# Altium schematic sheet CableNodeRevG.SchDoc: Cable Node (part 1 of 3)
size C; Date: 20 Nov 2013; Author: JDV; CompanyName: OPIsystems Inc; DrawnBy: JDV; Engineer: JDV; Organization: OPIsystems Inc; DocumentNumber: 20130211; Revision: Rev G; SheetNumber: 1; SheetTotal: 1; PageSetup: Record=PageOptions|CenterHorizontal=True|CenterVertical=True|PrintScale=0.54|XCorrection=1.00|YCorrection=1.00|PrintKind=0|BorderSize=5000000|LeftOffset=0|BottomOffset=0|Orientation=2|PaperLength=4318|PaperWidth=2794|Scale=100|PaperSource=7|PrintQuality=600|MediaType=1|DitherType=10|PaperKind=11x17|PrintScaleMode=1; DocumentName: Cable Node; ProjectName: Swage
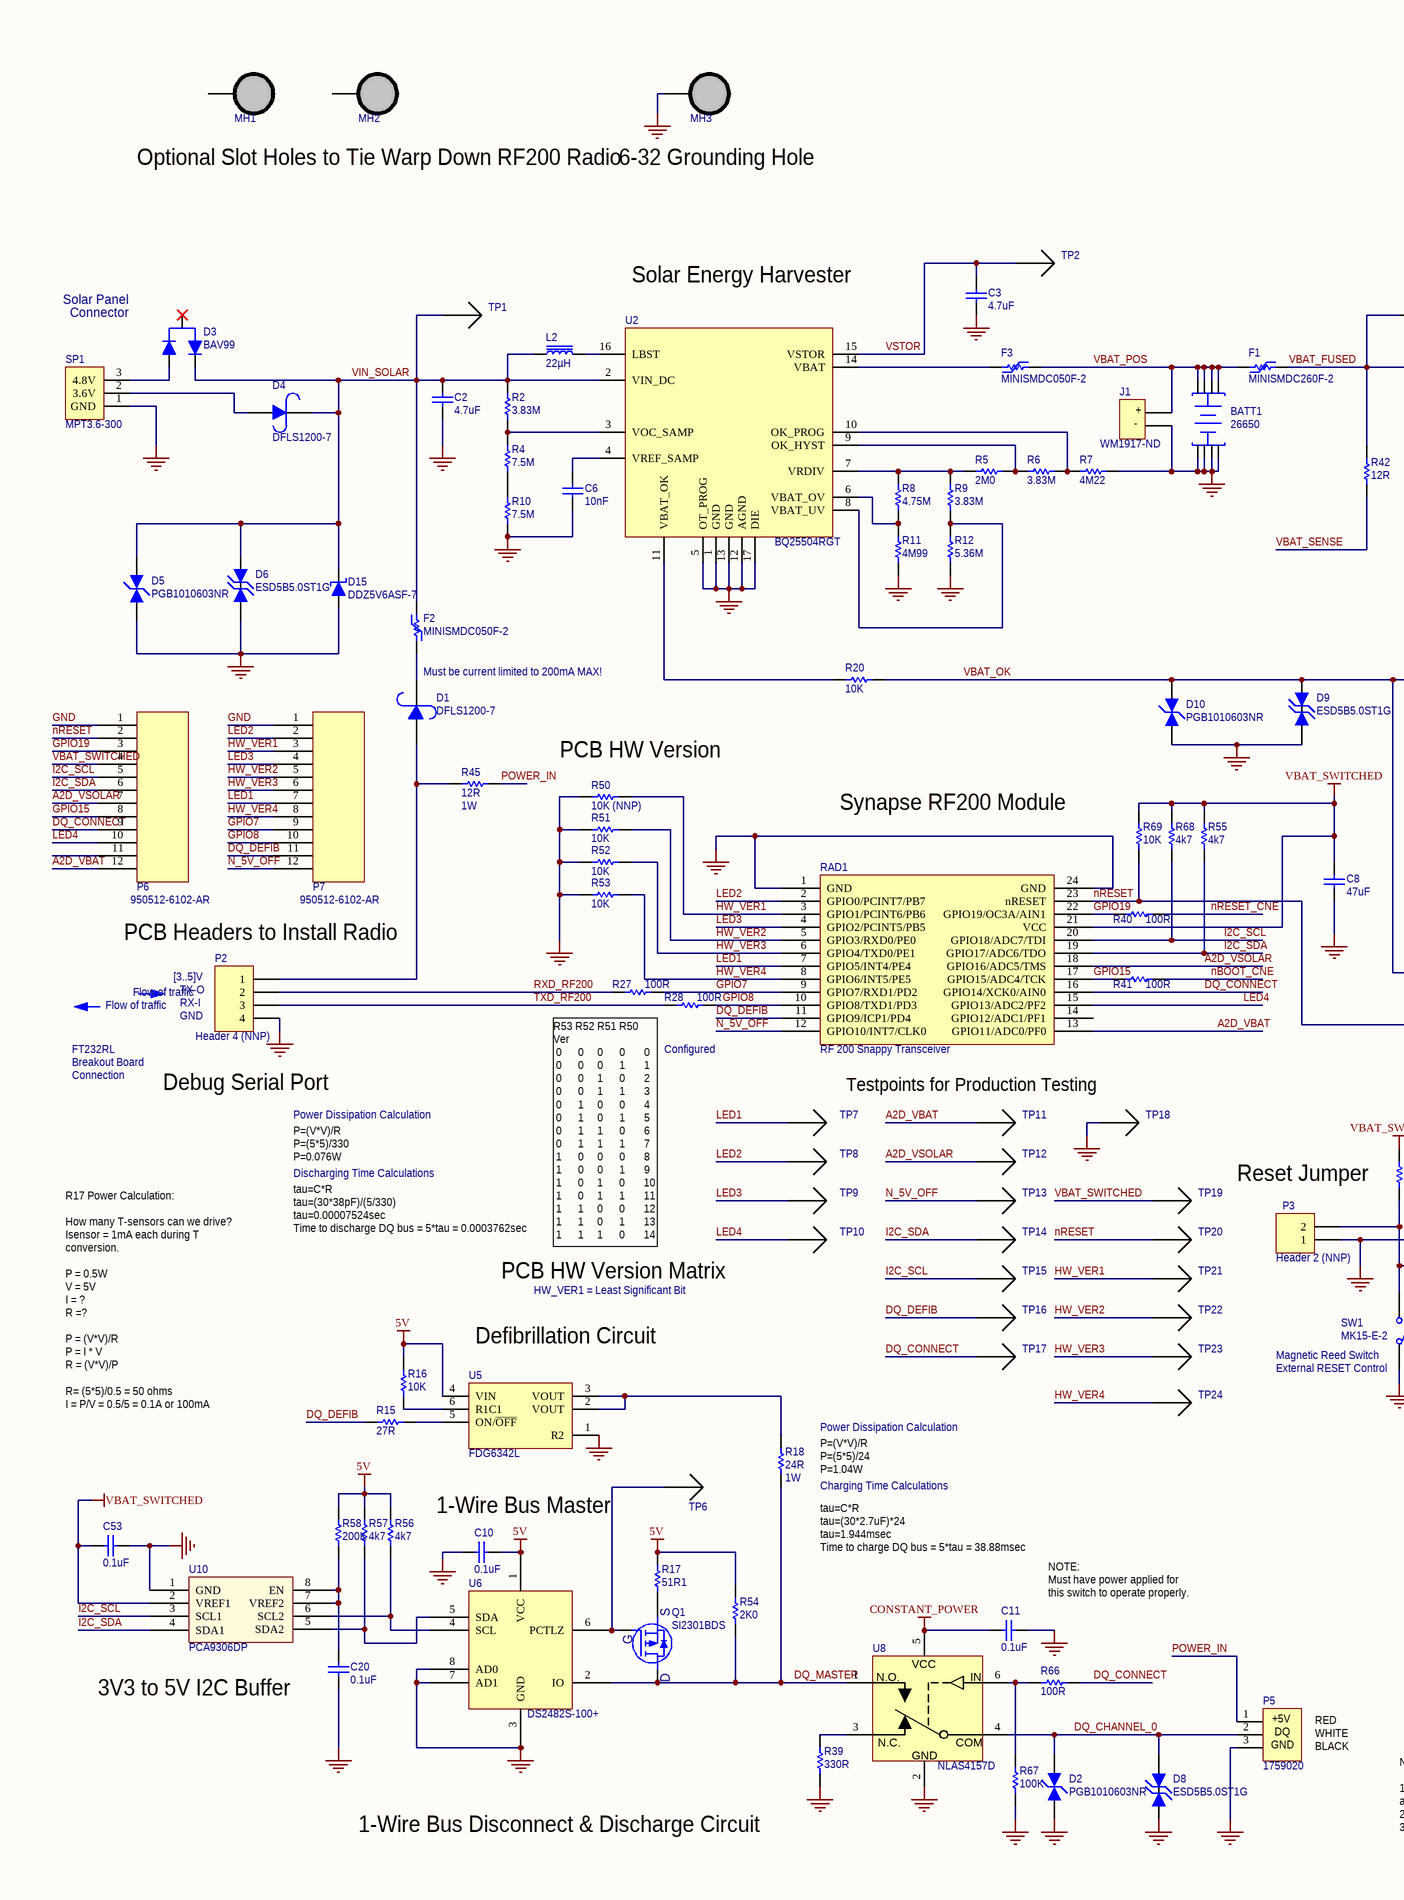
[diagram p0: CableNodeRevG.SchDoc, left]
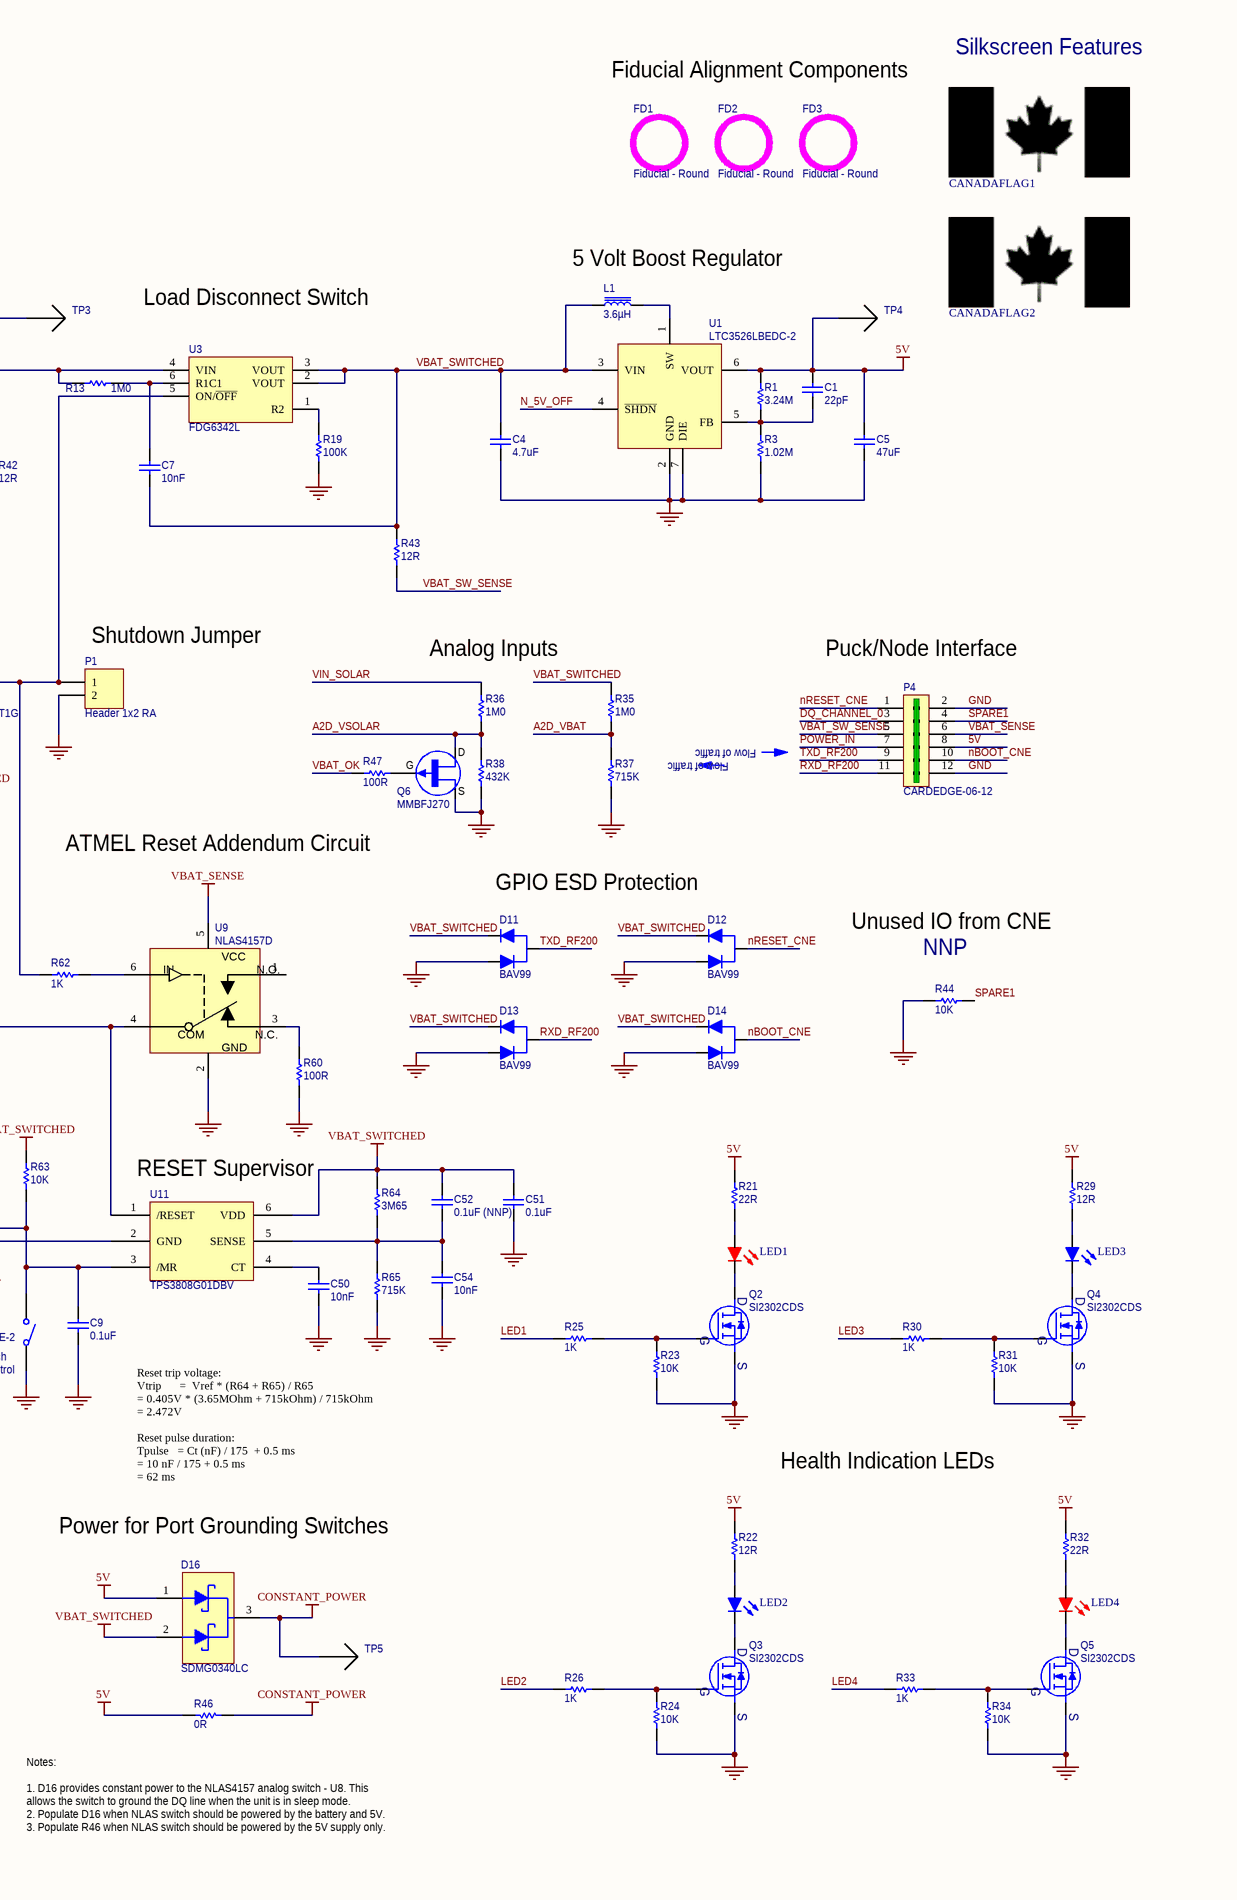
[diagram p1: CableNodeRevG.SchDoc, right]

## Parts
BATT1  26650  [Battery_26650]
C1  22pF  [RC0805]
C2  4.7uF  [RC0805]
C3  4.7uF  [RC0805]
C4  4.7uF  [RC0805]
C5  47uF  [RC1206]
C6  10nF  [RC0805]
C7  10nF  [RC0603]
C8  47uF  [RC1206]
C9  0.1uF  [RC0603]
C10  0.1uF  [RC0603]
C11  0.1uF  [RC0603]
C20  0.1uF  [RC0603]
C50  10nF  [RC0603]
C51  0.1uF  [RC0603]
C52  0.1uF (NNP)  [RC0603]
C53  0.1uF  [RC0603]
C54  10nF  [RC0603]
CANADAFLAG1  Canada Flag  [CanadaFlag500x250]  (value not drawn)
CANADAFLAG2  Canada Flag  [CanadaFlag500x250]  (value not drawn)
D1  DFLS1200-7  [POWERDI-123]
D2  PGB1010603NR  [RC0603]
D3  BAV99  [SOT23]
D4  DFLS1200-7  [POWERDI-123]
D5  PGB1010603NR  [RC0603]
D6  ESD5B5.0ST1G  [SOD-523]
D8  ESD5B5.0ST1G  [SOD-523]
D9  ESD5B5.0ST1G  [SOD-523]
D10  PGB1010603NR  [RC0603]
D11  BAV99  [SOT23]
D12  BAV99  [SOT23]
D13  BAV99  [SOT23]
D14  BAV99  [SOT23]
D15  DDZ5V6ASF-7  [SOD323F]
D16  SDMG0340LC  [SOT-323]
F1  MINISMDC260F-2  [MINISMDC260F]
F2  MINISMDC050F-2  [MINISMD050]
F3  MINISMDC050F-2  [MINISMD050]
FD1  Fiducial - Round  [FIDUCIAL ROUND SMALL]
FD2  Fiducial - Round  [FIDUCIAL ROUND SMALL]
FD3  Fiducial - Round  [FIDUCIAL ROUND SMALL]
J1  Supplier Part Number 1: WM1917-ND  [BATTERYCONNECTOR]  (hidden comment: CONN)
L1  3.6µH  [IND-WURTH]
L2  22µH  [IND-SRR0604]
LED1  GH_JTLPS1.24-K5L2-1-1-150-R33  [GHJTLPS124K5L211150R33]  (value not drawn)
LED2  GD JTLPS1.14-MFN8-25-1-150-R33  [GHJTLPS124K5L211150R33]  (value not drawn)
LED3  GD JTLPS1.14-MFN8-25-1-150-R33  [GHJTLPS124K5L211150R33]  (value not drawn)
LED4  GH_JTLPS1.24-K5L2-1-1-150-R33  [GHJTLPS124K5L211150R33]  (value not drawn)
MH1  MountingHole  [MountingHole]  (value not drawn)
MH2  MountingHole  [MountingHole]  (value not drawn)
MH3  MountingHole  [MountingHole]  (value not drawn)
P1  Header 1x2 RA  [HDR1X2]
P2  Header 4 (NNP)  [HDR1X4]
P3  Header 2 (NNP)  [HDR1X2]
P4  CARDEDGE-06-12  [EdgeConnectorFingers]
P5  1759020  [PC-1759020]
P6  Manufacturer Part Number: 950512-6102-AR  [HEADER1X12-2MM]  (hidden comment: 3M-950512-6102-AR)
P7  Manufacturer Part Number: 950512-6102-AR  [HEADER1X12-2MM]  (hidden comment: 3M-950512-6102-AR)
Q1  SI2301BDS  [SOT23(DGS)]
Q2  SI2302CDS  [SOT23]
Q3  SI2302CDS  [SOT23]
Q4  SI2302CDS  [SOT23]
Q5  SI2302CDS  [SOT23]
Q6  MMBFJ270  [SOT23]
R1  3.24M  [RC0805]
R2  3.83M  [RC0603]
R3  1.02M  [RC0805]
R4  7.5M  [RC0603]
R5  2M0  [RC0603]
R6  3.83M  [RC0603]
R7  4M22  [RC0603]
R8  4.75M  [rc0603]
R9  3.83M  [RC0603]
R10  7.5M  [RC0603]
R11  4M99  [rc0603]
R12  5.36M  [RC0603]
R13  1M0  [RESC1608X06N]
R15  27R  [RC0603]
R16  10K  [RC0603]
R17  51R1  [RC3225X07N]
R18  24R  Power (Watts): 1W  [RES2512]
R19  100K  [RC0603]
R20  10K  [RC0603]
R21  22R  [RC1206]
R22  12R  [RC1206]
R23  10K  [RC0603]
R24  10K  [RC0603]
R25  1K  [rc0603]
R26  1K  [rc0603]
R27  100R  [RC0603]
R28  100R  [RC0603]
R29  12R  [RC1206]
R30  1K  [rc0603]
R31  10K  [RC0603]
R32  22R  [RC1206]
R33  1K  [rc0603]
R34  10K  [RC0603]
R35  1M0  [rc0603]
R36  1M0  [rc0603]
R37  715K  [RC0603]
R38  432K  [RC0603]
R39  330R  [RC0805]
R40  100R  [RC0603]
R41  100R  [RC0603]
R42  12R  [RC1206]
R43  12R  [RC1206]
R44  10K  [RC0603]
R45  12R  Power (Watts): 1W  [RES2512]
R46  0R  [RC0603]
R47  100R  [RC0603]
R50  10K (NNP)  [RC0603]
R51  10K  [RC0603]
R52  10K  [RC0603]
R53  10K  [RC0603]
R54  2K0  [RC0603]
R55  4k7  [RC0603]
R56  4k7  [RC0603]
R57  4k7  [RC0603]
R58  200K  [RC0603]
R60  100R  [RC0603]
R62  1K  [rc0603]
R63  10K  [RC0603]
R64  3M65  [RC0603]
R65  715K  [RC0603]
R66  100R  [RC0603]
R67  100K  [RC0603]
R68  4k7  [RC0603]
R69  10K  [RC0603]
RAD1  RF 200 Snappy Transceiver  [RF200]
SP1  MPT3.6-300  [SOLAR_PANEL_FLEX]
SW1  MK15-E-2  [MK15-E-2]
TP1  Testpoint  [TestPoint]  (value not drawn)
TP2  Testpoint  [TestPoint]  (value not drawn)
TP3  Testpoint  [TestPoint]  (value not drawn)
TP4  Testpoint  [TestPoint]  (value not drawn)
TP5  Testpoint  [TestPoint]  (value not drawn)
TP6  Testpoint  [TestPoint]  (value not drawn)
TP7  Testpoint  [TestPoint]  (value not drawn)
TP8  Testpoint  [TestPoint]  (value not drawn)
TP9  Testpoint  [TestPoint]  (value not drawn)
TP10  Testpoint  [TestPoint]  (value not drawn)
TP11  Testpoint  [TestPoint]  (value not drawn)
TP12  Testpoint  [TestPoint]  (value not drawn)
TP13  Testpoint  [TestPoint]  (value not drawn)
TP14  Testpoint  [TestPoint]  (value not drawn)
TP15  Testpoint  [TestPoint]  (value not drawn)
TP16  Testpoint  [TestPoint]  (value not drawn)
TP17  Testpoint  [TestPoint]  (value not drawn)
TP18  Testpoint  [TestPoint]  (value not drawn)
TP19  Testpoint  [TestPoint]  (value not drawn)
TP20  Testpoint  [TestPoint]  (value not drawn)
TP21  Testpoint  [TestPoint]  (value not drawn)
TP22  Testpoint  [TestPoint]  (value not drawn)
TP23  Testpoint  [TestPoint]  (value not drawn)
TP24  Testpoint  [TestPoint]  (value not drawn)
U1  LTC3526LBEDC-2  [LTC3526]
U2  BQ25504RGT  [BQ25504]
U3  FDG6342L  [TS5A3160]
U5  FDG6342L  [TS5A3160]
U6  DS2482S-100+  [SOIC127P580X153-8N]
U8  NLAS4157D  [TS5A3160]
U9  NLAS4157D  [TS5A3160]
U10  PCA9306DP  [TSOP65P640X120-8N]
U11  TPS3808G01DBV  [SOT95P270X145-6N]

## Nets
5V: C1.2 C5.2 C10.2 D16.1(A) P4.8(DESIGNATOR=8) R1.2 R16.2 R17.1 R21.1 R22.1 R29.1 R32.1 R46.1 R54.1 R56.2 R57.2 R58.1 TP4.1 U1.6(VOUT) U5.4(VIN) U6.1(VCC)
CONSTANT_POWER: C11.1 D16.3(K) R46.2 TP5.1 U8.5
GND: BATT1.5 BATT1.6 BATT1.7 BATT1.8 C2.1 C3.1 C4.1 C5.1 C6.1 C8.1 C9.1 C10.1 C11.2 C20.1 C50.1 C51.1 C53.1 C54.1 D2.1 D5.1 D6.2 D8.1 D9.2 D10.1 D11.1(A) D12.1(A) D13.1(A) D14.1(A) D15.2 J1.2 MH3.1 P1.2 P2.4 P3.1 P4.2(DESIGNATOR=2) P4.12(DESIGNATOR=12) P5.3 P6.1 P7.1 Q2.2(S) Q3.2(S) Q4.2(S) Q5.2(S) Q6.2(S) R3.2 R7.2 R10.2 R11.2 R12.2 R19.2 R23.2 R24.2 R31.2 R34.2 R37.1 R38.1 R39.2 R44.1 R50.2 R51.2 R52.2 R53.2 R60.2 R65.1 R67.2 RAD1.1(GND) RAD1.24(GND) SP1.1(GND) SW1.1 TP18.1 U1.2(GND) U1.7(DIE) U2.1(GND) U2.5(OT_PROG) U2.12(AGND) U2.13(GND) U2.17(DIE) U5.1(R2) U6.3(GND) U6.7(AD1) U6.8(AD0) U8.2(GND) U9.2(GND) U10.1(GND) U11.2(GND)
VBAT_SENSE: P4.6(DESIGNATOR=6) R42.2 U9.5
VBAT_SWITCHED: C4.2 C7.1 C8.2 C51.2 C52.2 C53.2 D11.2(K) D12.2(K) D13.2(K) D14.2(K) D16.2(A) L1.A P6.4 R35.1 R43.1 R55.2 R63.1 R64.1 R68.2 R69.1 RAD1.21(VCC) TP19.1 U1.3(VIN) U3.2(VOUT) U3.3(VOUT) U10.2(VREF1) U11.6(VDD)
A2D_VBAT: P6.12 R35.2 R37.2 RAD1.13(GPIO11/ADC0/PF0) TP11.1
A2D_VSOLAR: P6.7 Q6.1(D) R36.2 R38.2 RAD1.18(GPIO16/ADC5/TMS) TP12.1
DQ_CHANNEL_0: D2.2 D8.2 P4.3(DESIGNATOR=3) P5.2 U8.4
DQ_CONNECT: P6.9 R66.1 RAD1.16(GPIO14/XCK0/AIN0) TP17.1
DQ_DEFIB: P7.11 R15.1 RAD1.11(GPIO9/ICP1/PD4) TP16.1
DQ_MASTER: Q1.D R18.2 R54.2 U6.2(IO) U8.1(NO)
GPIO7: P7.9 R27.1 RAD1.9(GPIO7/RXD1/PD2)
GPIO8: P7.10 R28.1 RAD1.10(GPIO8/TXD1/PD3)
GPIO15: P6.8 R41.2 RAD1.17(GPIO15/ADC4/TCK)
GPIO19: P6.3 R40.2 RAD1.22(GPIO19/OC3A/AIN1)
HW_VER1: P7.3 R50.1 RAD1.3(GPIO1/PCINT6/PB6) TP21.1
HW_VER2: P7.5 R51.1 RAD1.5(GPIO3/RXD0/PE0) TP22.1
HW_VER3: P7.6 R52.1 RAD1.6(GPIO4/TXD0/PE1) TP23.1
HW_VER4: P7.8 R53.1 RAD1.8(GPIO6/INT5/PE5) TP24.1
I2C_SCL: P6.5 R68.1 RAD1.20(GPIO18/ADC7/TDI) TP15.1 U10.3(SCL1)
I2C_SDA: P6.6 R55.1 RAD1.19(GPIO17/ADC6/TDO) TP14.1 U10.4(SDA1)
LED1: P7.7 R25.1 RAD1.7(GPIO5/INT4/PE4) TP7.1
LED2: P7.2 R26.1 RAD1.2(GPIO0/PCINT7/PB7) TP8.1
LED3: P7.4 R30.1 RAD1.4(GPIO2/PCINT5/PB5) TP9.1
LED4: P6.10 R33.1 RAD1.15(GPIO13/ADC2/PF2) TP10.1
N_5V_OFF: P7.12 RAD1.12(GPIO10/INT7/CLK0) TP13.1 U1.4(~{SHDN})
nBOOT_CNE: D14.3 P4.10(DESIGNATOR=10) R41.1
nRESET: P6.2 R69.2 RAD1.23(nRESET) TP20.1 U9.4 U11.1(/RESET)
nRESET_CNE: D12.3 P4.1(DESIGNATOR=1) R40.1
POWER_IN: P4.7(DESIGNATOR=7) P5.1 R45.1
RXD_RF200: D13.3 P2.2 P4.11(DESIGNATOR=11) R27.2
SPARE1: P4.4(DESIGNATOR=4) R44.2
TXD_RF200: D11.3 P2.3 P4.9(DESIGNATOR=9) R28.2
VBAT_FUSED: F1.1 R13.2 R42.1 TP3.1 U3.4(VIN)
VBAT_OK: D9.1 D10.2 P1.1 R20.1 R47.2 R62.2 U3.5(ON/~{OFF})
VBAT_POS: BATT1.1 BATT1.2 BATT1.3 BATT1.4 F1.2 F3.1 J1.1
VBAT_SW_SENSE: P4.5(DESIGNATOR=5) R43.2
VIN_SOLAR: C2.2 D3.2(K) D4.2(K) D5.2 D6.1 D15.1 F2.1 L2.A R2.2 R36.1 TP1.1 U2.2(VIN_DC)
VSTOR: C3.2 TP2.1 U2.15(VSTOR)
NetC1_1: C1.1 R1.1 R3.1 U1.5(FB)
NetC6_2: C6.2 U2.4(VREF_SAMP)
NetC7_2: C7.2 R13.1 U3.6(R1C1)
NetC9_2: C9.2 P3.2 R63.2 SW1.2 U11.3(/MR)
NetC20_2: C20.2 R58.2 U10.7(VREF2) U10.8(EN)
NetC50_2: C50.2 U11.4(CT)
NetC52_1: C52.1 C54.2 R64.2 R65.2 U11.5(SENSE)
NetD1_1: D1.1(A) P2.1 R45.2
NetD1_2: D1.2(K) F2.2
NetD3_1: D3.1(A) SP1.3(4.8V)
NetD4_1: D4.1(A) SP1.2(3.6V)
NetF3_2: F3.2 U2.14(VBAT)
NetL1_B: L1.B U1.1(SW)
NetL2_B: L2.B U2.16(LBST)
NetLED1_A: LED1.A R21.2
NetLED1_K: LED1.K Q2.3(D)
NetLED2_A: LED2.A R22.2
NetLED2_K: LED2.K Q3.3(D)
NetLED3_A: LED3.A R29.2
NetLED3_K: LED3.K Q4.3(D)
NetLED4_A: LED4.A R32.2
NetLED4_K: LED4.K Q5.3(D)
NetQ1_G: Q1.G TP6.1 U6.6(PCTLZ)
NetQ1_S: Q1.S R17.2
NetQ2_1: Q2.1(G) R23.1 R25.2
NetQ3_1: Q3.1(G) R24.1 R26.2
NetQ4_1: Q4.1(G) R30.2 R31.1
NetQ5_1: Q5.1(G) R33.2 R34.1
NetQ6_3: Q6.3(G) R47.1
NetR2_1: R2.1 R4.2 U2.3(VOC_SAMP)
NetR4_1: R4.1 R10.1
NetR5_1: R5.1 R6.2 U2.9(OK_HYST)
NetR5_2: R5.2 R8.1 R9.2 U2.7(VRDIV)
NetR6_1: R6.1 R7.1 U2.10(OK_PROG)
NetR8_2: R8.2 R11.1 U2.6(VBAT_OV)
NetR9_1: R9.1 R12.1 U2.8(VBAT_UV)
NetR15_2: R15.2 U5.5(ON/~{OFF})
NetR16_1: R16.1 U5.6(R1C1)
NetR18_1: R18.1 U5.2(VOUT) U5.3(VOUT)
NetR19_1: R19.1 U3.1(R2)
NetR20_2: R20.2 U2.11(VBAT_OK)
NetR39_1: R39.1 U8.3(NC)
NetR56_1: R56.1 U6.4(SCL) U10.6(SCL2)
NetR57_1: R57.1 U6.5(SDA) U10.5(SDA2)
NetR60_1: R60.1 U9.3(NC)
NetR62_1: R62.1 U9.6
NetR66_2: R66.2 R67.1 U8.6

Not connected (* = marked no-connect by the designer): D3 3*; MH1 1; MH2 1; P6 11; RAD1 14(GPIO12/ADC1/PF1); U9 1(NO)

## Notes on the sheet
- (near CANADAFLAG1) Silkscreen Features
- (near CANADAFLAG1) Fiducial Alignment Components
- Optional Slot Holes to Tie Warp Down RF200 Radio
- 6-32 Grounding Hole
- (near L1) 5 Volt Boost Regulator
- (near D3) Solar Panel
- Connector
- Solar Energy Harvester
- Load Disconnect Switch
- (near P1) Shutdown Jumper
- Analog Inputs
- (near P4) Puck/Node Interface
- Must be current limited to 200mA MAX!
- (near R50) PCB HW Version
- Flow of traffic
- Synapse RF200 Module
- ATMEL Reset Addendum Circuit
- GPIO ESD Protection
- PCB Headers to Install Radio
- (near P2) [3..5]V
- Unused IO from CNE
- (near R44) NNP
- (near P2) TX-O
- (near P2) RX-I
- GND
- FT232RL
- Breakout Board
- Connection
- Debug Serial Port
- Configured
- Testpoints for Production Testing
- P=(V*V)/R
  P=(5*5)/330
  P=0.076W
- Power Dissipation Calculation
- Discharging Time Calculations
- (near U11) RESET Supervisor
- (near R63) Reset Jumper
- tau=C*R
  tau=(30*38pF)/(5/330)
  tau=0.00007524sec
  Time to discharge DQ bus = 5*tau = 0.0003762sec
- PCB HW Version Matrix
- HW_VER1 = Least Significant Bit
- R53 R52 R51 R50  Ver
  0      0     0      0       0
  0      0     0      1       1
  0      0     1      0       2
  0      0     1      1       3
  0      1     0      0       4
  0      1     0      1       5
  0      1     1      0       6
  0      1     1      1       7
  1      0     0      0       8
  1      0     0      1       9
  1      0     1      0       10
  1      0     1      1       11
  1      1     0      0       12
  1      1     0      1       13
  1      1     1      0       14
  1      1     1      1       15
- (near U5) Defibrillation Circuit
- (near SW1) Magnetic Reed Switch
- R17 Power Calculation:
  How many T-sensors can we drive?
  Isensor = 1mA each during T conversion.
  P = 0.5W
  V = 5V
  I = ?
  R =?
  P = (V*V)/R
  P = I * V
  R = (V*V)/P
  R= (5*5)/0.5 = 50 ohms
  I = P/V = 0.5/5 = 0.1A or 100mA
  We can drive 100 T-sensors with 51.1 ohm, 0.5W resistor.
- (near R18) Power Dissipation Calculation
- (near SW1) External RESET Control
- (near R18) P=(V*V)/R
  P=(5*5)/24
  P=1.04W
- (near R18) Charging Time Calculations
- Reset trip voltage:
  Vtrip      =  Vref * (R64 + R65) / R65
  = 0.405V * (3.65MOhm + 715kOhm) / 715kOhm
  = 2.472V
  Reset pulse duration:
  Tpulse   = Ct (nF) / 175  + 0.5 ms
  = 10 nF / 175 + 0.5 ms
  = 62 ms
- Health Indication LEDs
- 1-Wire Bus Master
- tau=C*R
  tau=(30*2.7uF)*24
  tau=1.944msec
  Time to charge DQ bus = 5*tau = 38.88msec
- Power for Port Grounding Switches
- (near C11) NOTE:
  Must have power applied for this switch to operate properly.
- (near C20) 3V3 to 5V I2C Buffer
- RED
- WHITE
- BLACK
- 1-Wire Bus Disconnect & Discharge Circuit
- (near R46) Notes:
  1. D16 provides constant power to the NLAS4157 analog switch - U8. This allows the switch to ground the DQ line when the unit is in sleep mode.
  2. Populate D16 when NLAS switch should be powered by the battery and 5V.
  3. Populate R46 when NLAS switch should be powered by the 5V supply only.
- Title:
- OPIsystems Inc.
- Size:
- Date:
- File:
- C
- Number:
- Time:
- Revision:
- Sheet
- of
- Calgary, AB, Canada
- T2E 6M8
- 403-219-3177
- www.opisystems.com
- 1216 - 36th Avenue NE
- (in symbol 1759020) +5V; DQ; GND
- (in symbol 436500216) +
- (in symbol NLAS4157DFT2G) VCC; N.O.; IN; N.C.; COM